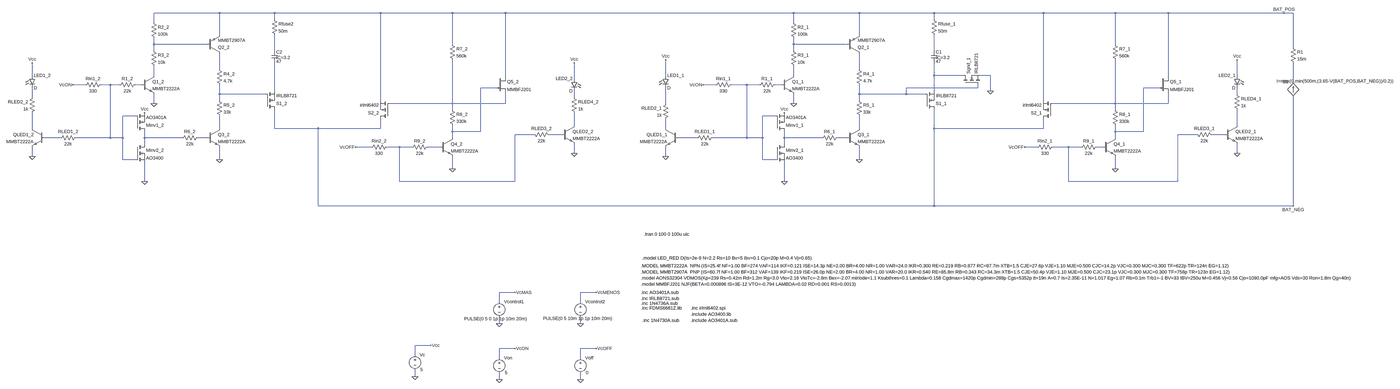
[diagram p0: schematic paralelo.asc, whole sheet]
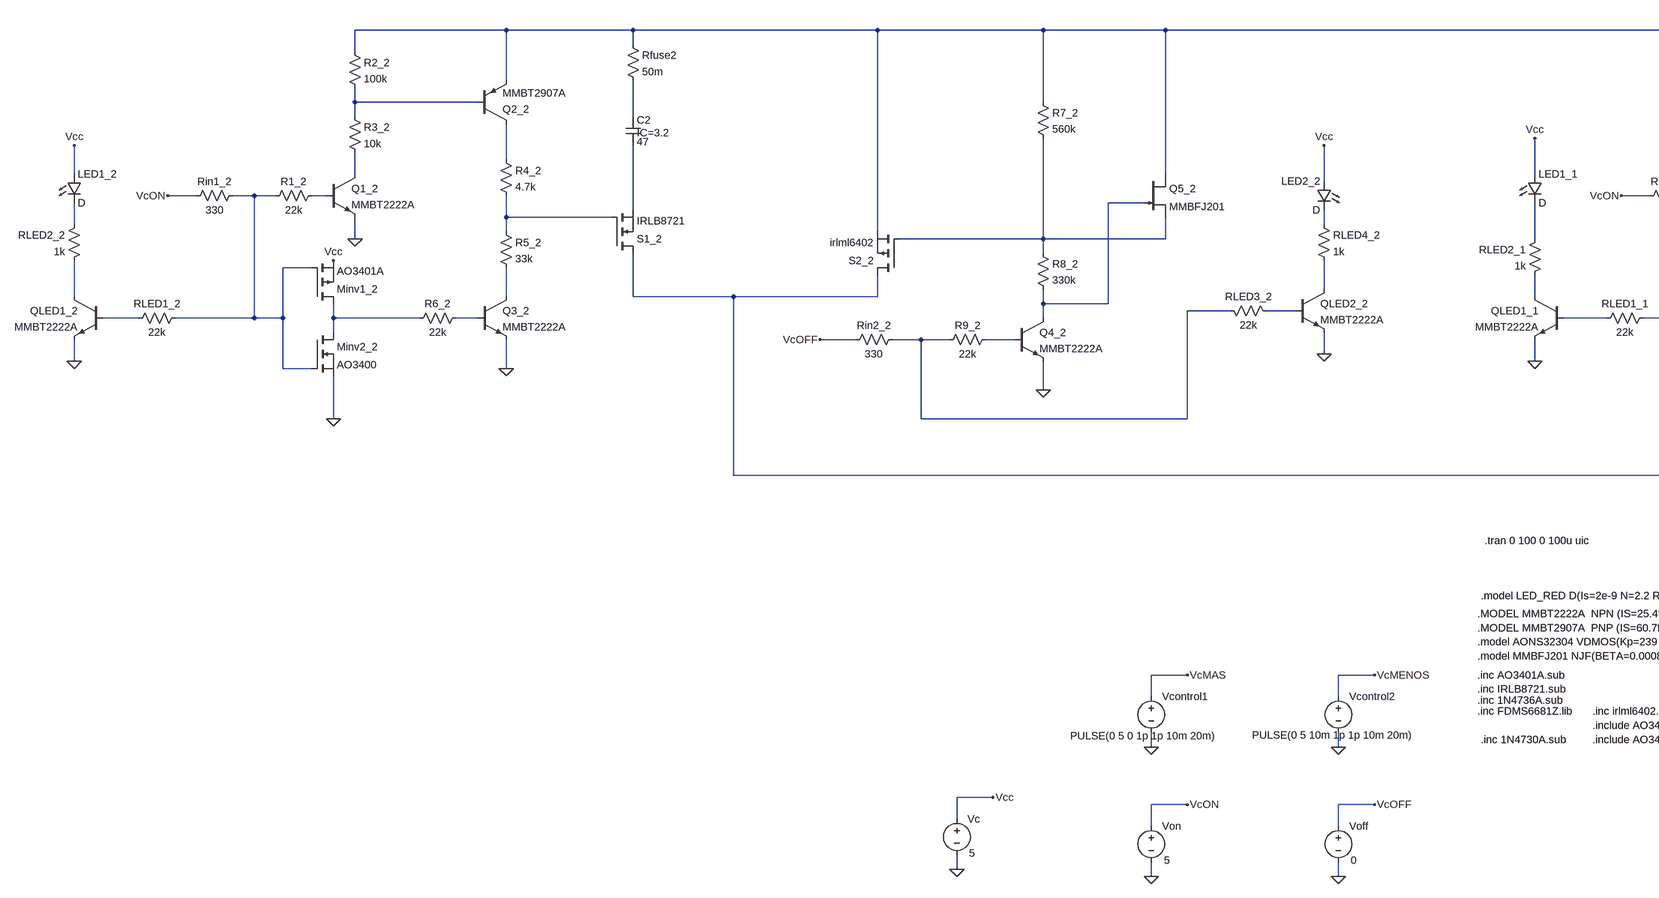
[diagram p1: schematic paralelo.asc, part, row 1 of 1, column 1 of 2]
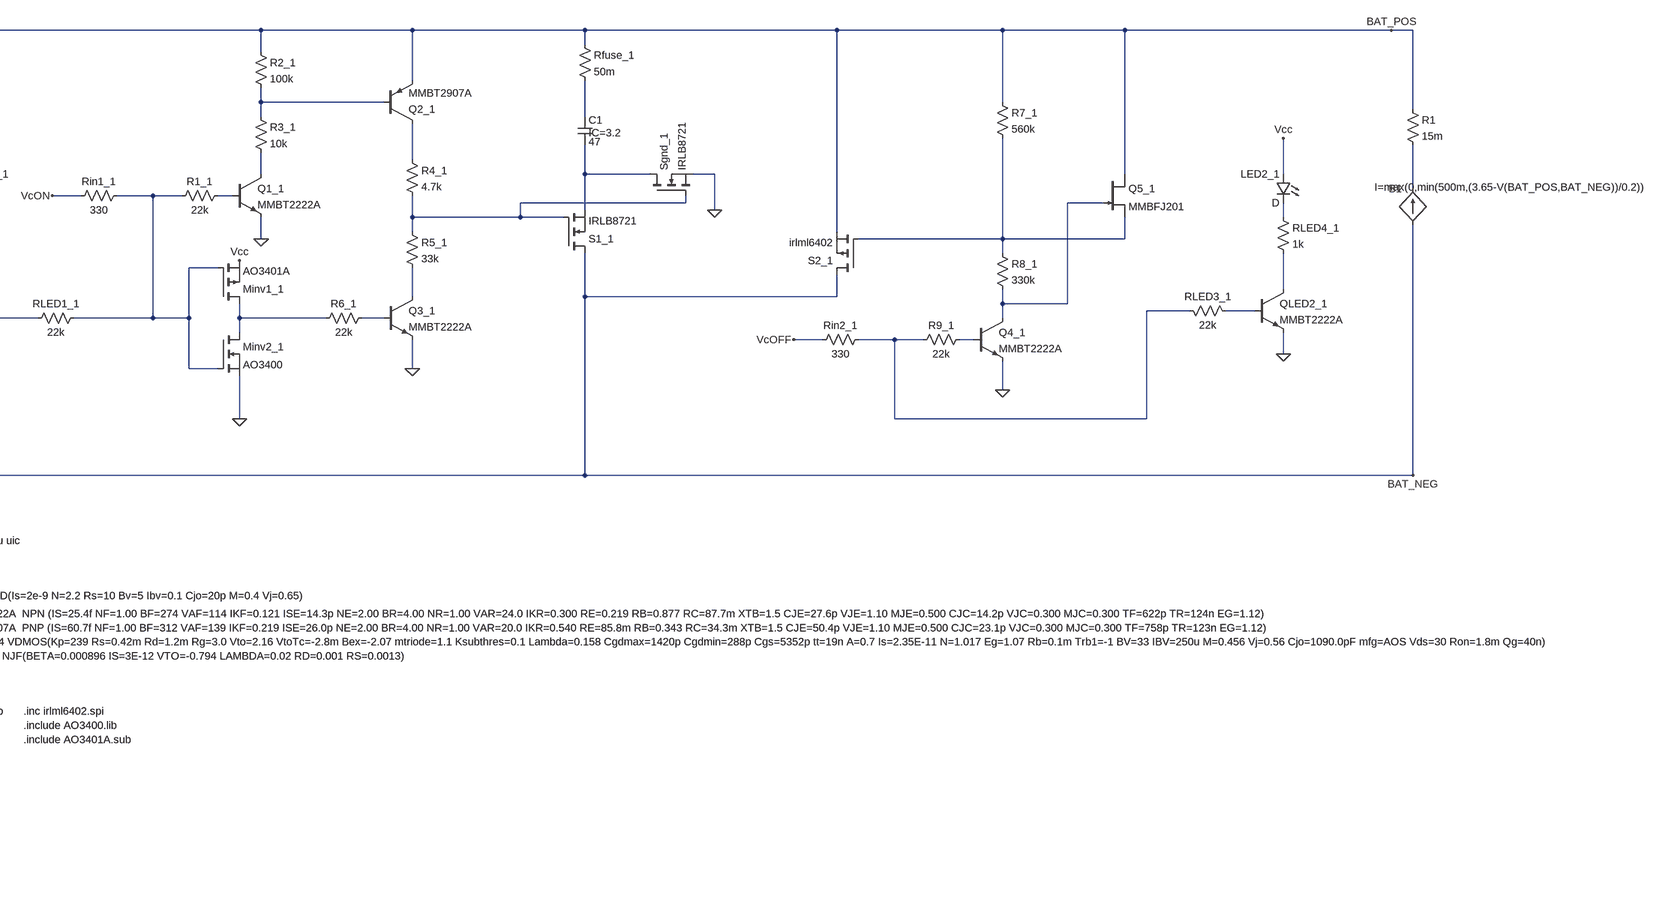
[diagram p2: schematic paralelo.asc, part, row 1 of 1, column 2 of 2]
paralelo.asc, the LTspice schematic file:
Version 4.1
SHEET 1 7672 2128
WIRE -2704 -688 -3040 -688
WIRE -2320 -688 -2704 -688
WIRE -1760 -688 -2320 -688
WIRE -1392 -688 -1760 -688
WIRE -1120 -688 -1392 -688
WIRE 560 -688 -1120 -688
WIRE 896 -688 560 -688
WIRE 1280 -688 896 -688
WIRE 1840 -688 1280 -688
WIRE 2208 -688 1840 -688
WIRE 2480 -688 2208 -688
WIRE 3072 -688 2480 -688
WIRE 3120 -688 3072 -688
WIRE -2320 -656 -2320 -688
WIRE 1280 -656 1280 -688
WIRE -3040 -640 -3040 -688
WIRE 560 -640 560 -688
WIRE -2704 -576 -2704 -688
WIRE 896 -576 896 -688
WIRE -3040 -528 -3040 -560
WIRE -2768 -528 -3040 -528
WIRE -1392 -528 -1392 -688
WIRE 560 -528 560 -560
WIRE 832 -528 560 -528
WIRE 2208 -528 2208 -688
WIRE 3120 -512 3120 -688
WIRE -3040 -496 -3040 -528
WIRE -2320 -496 -2320 -576
WIRE 560 -496 560 -528
WIRE 1280 -496 1280 -576
WIRE -2704 -400 -2704 -480
WIRE 896 -400 896 -480
WIRE -3664 -368 -3664 -432
WIRE -3040 -368 -3040 -416
WIRE -1120 -368 -1120 -688
WIRE -96 -368 -96 -448
WIRE 560 -368 560 -416
WIRE 1280 -368 1280 -432
WIRE 1424 -368 1280 -368
WIRE 1568 -368 1520 -368
WIRE 2480 -368 2480 -688
WIRE 2832 -368 2832 -448
WIRE -768 -352 -768 -432
WIRE 3120 -336 3120 -432
WIRE -3392 -320 -3456 -320
WIRE -3264 -320 -3312 -320
WIRE -3216 -320 -3264 -320
WIRE -3104 -320 -3136 -320
WIRE 160 -320 96 -320
WIRE 320 -320 240 -320
WIRE 384 -320 320 -320
WIRE 496 -320 464 -320
WIRE -1168 -304 -1248 -304
WIRE 1504 -304 1504 -320
WIRE 1504 -304 1136 -304
WIRE 2432 -304 2352 -304
WIRE -2320 -288 -2320 -432
WIRE 1280 -288 1280 -368
WIRE 1568 -288 1568 -368
WIRE -2704 -272 -2704 -320
WIRE -2368 -272 -2704 -272
WIRE 896 -272 896 -320
WIRE 1136 -272 1136 -304
WIRE 1136 -272 896 -272
WIRE 1232 -272 1136 -272
WIRE 2832 -272 2832 -304
WIRE -3664 -256 -3664 -304
WIRE -768 -256 -768 -288
WIRE -2704 -240 -2704 -272
WIRE -1760 -240 -1760 -688
WIRE 896 -240 896 -272
WIRE 1840 -240 1840 -688
WIRE -3040 -224 -3040 -272
WIRE -1392 -224 -1392 -448
WIRE -1392 -224 -1712 -224
WIRE -1120 -224 -1120 -272
WIRE -1120 -224 -1392 -224
WIRE -96 -224 -96 -304
WIRE 560 -224 560 -272
WIRE 2208 -224 2208 -448
WIRE 2208 -224 1888 -224
WIRE 2480 -224 2480 -272
WIRE 2480 -224 2208 -224
WIRE -1392 -192 -1392 -224
WIRE 2208 -192 2208 -224
WIRE -3136 -160 -3200 -160
WIRE 464 -160 400 -160
WIRE -768 -112 -768 -176
WIRE 2832 -112 2832 -192
WIRE -3664 -96 -3664 -176
WIRE -2704 -96 -2704 -160
WIRE -2320 -96 -2320 -192
WIRE -2080 -96 -2320 -96
WIRE -1760 -96 -1760 -144
WIRE -1760 -96 -2080 -96
WIRE -96 -96 -96 -144
WIRE 896 -96 896 -160
WIRE 1280 -96 1280 -192
WIRE 1840 -96 1840 -144
WIRE 1840 -96 1280 -96
WIRE -1392 -80 -1392 -112
WIRE -1248 -80 -1248 -304
WIRE -1248 -80 -1392 -80
WIRE 2208 -80 2208 -112
WIRE 2352 -80 2352 -304
WIRE 2352 -80 2208 -80
WIRE -976 -64 -1072 -64
WIRE -832 -64 -896 -64
WIRE 2624 -64 2528 -64
WIRE 2768 -64 2704 -64
WIRE -3520 -48 -3600 -48
WIRE -3264 -48 -3264 -320
WIRE -3264 -48 -3440 -48
WIRE -3200 -48 -3200 -160
WIRE -3200 -48 -3264 -48
WIRE -3088 -48 -3088 -80
WIRE -2896 -48 -3088 -48
WIRE -2768 -48 -2816 -48
WIRE -1392 -48 -1392 -80
WIRE 64 -48 -32 -48
WIRE 320 -48 320 -320
WIRE 320 -48 144 -48
WIRE 400 -48 400 -160
WIRE 400 -48 320 -48
WIRE 512 -48 512 -80
WIRE 704 -48 512 -48
WIRE 832 -48 784 -48
WIRE 2208 -48 2208 -80
WIRE -3088 -16 -3088 -48
WIRE 512 -16 512 -48
WIRE -1808 0 -1888 0
WIRE -1664 0 -1728 0
WIRE -1600 0 -1664 0
WIRE -1456 0 -1520 0
WIRE 1808 0 1744 0
WIRE 1968 0 1888 0
WIRE 2032 0 1968 0
WIRE 2144 0 2112 0
WIRE -768 32 -768 -16
WIRE 2832 32 2832 -16
WIRE -3664 48 -3664 0
WIRE -96 48 -96 0
WIRE -3200 64 -3200 -48
WIRE -3136 64 -3200 64
WIRE -2704 64 -2704 0
WIRE 400 64 400 -48
WIRE 464 64 400 64
WIRE 896 64 896 0
WIRE -1392 112 -1392 48
WIRE 2208 112 2208 48
WIRE -3088 176 -3088 80
WIRE -1664 176 -1664 0
WIRE -1072 176 -1072 -64
WIRE -1072 176 -1664 176
WIRE 512 176 512 80
WIRE 1968 176 1968 0
WIRE 2528 176 2528 -64
WIRE 2528 176 1968 176
WIRE -2080 320 -2080 -96
WIRE 1280 320 1280 -96
WIRE 1280 320 -2080 320
WIRE 3120 320 3120 -256
WIRE 3120 320 1280 320
WIRE -1072 1024 -1152 1024
WIRE -656 1024 -736 1024
WIRE -1152 1072 -1152 1024
WIRE -736 1072 -736 1024
WIRE -1152 1184 -1152 1152
WIRE -736 1184 -736 1152
WIRE -1504 1296 -1584 1296
WIRE -1072 1312 -1152 1312
WIRE -656 1312 -736 1312
WIRE -1584 1344 -1584 1296
WIRE -1152 1360 -1152 1312
WIRE -736 1360 -736 1312
WIRE -1584 1456 -1584 1424
WIRE -1152 1472 -1152 1440
WIRE -736 1472 -736 1440
FLAG 560 -224 0
FLAG 896 64 0
FLAG -1152 1184 0
FLAG -736 1184 0
FLAG -1072 1024 VcMAS
FLAG -656 1024 VcMENOS
FLAG -736 1472 0
FLAG -656 1312 VcOFF
FLAG -1152 1472 0
FLAG -1072 1312 VcON
FLAG 96 -320 VcON
FLAG 2208 112 0
FLAG 1744 0 VcOFF
FLAG -96 48 0
FLAG 2832 32 0
FLAG -96 -448 Vcc
FLAG 2832 -448 Vcc
FLAG -1584 1456 0
FLAG -1504 1296 Vcc
FLAG 512 176 0
FLAG 512 -176 Vcc
FLAG 1568 -288 0
FLAG -3040 -224 0
FLAG -2704 64 0
FLAG -3456 -320 VcON
FLAG -1392 112 0
FLAG -1888 0 VcOFF
FLAG -3664 48 0
FLAG -768 32 0
FLAG -3664 -432 Vcc
FLAG -768 -432 Vcc
FLAG -3088 176 0
FLAG -3088 -176 Vcc
FLAG 3120 320 BAT_NEG
FLAG 3072 -688 BAT_POS
SYMBOL npn 832 -96 R0
SYMATTR InstName Q3_1
SYMATTR Value MMBT2222A
SYMBOL res 880 -256 R0
SYMATTR InstName R5_1
SYMATTR Value 33k
SYMBOL res 880 -416 R0
SYMATTR InstName R4_1
SYMATTR Value 4.7k
SYMBOL npn 496 -368 R0
SYMATTR InstName Q1_1
SYMATTR Value MMBT2222A
SYMBOL res 544 -512 R0
SYMATTR InstName R3_1
SYMATTR Value 10k
SYMBOL res 544 -656 R0
SYMATTR InstName R2_1
SYMATTR Value 100k
SYMBOL res 800 -64 R90
WINDOW 0 0 56 VBottom 2
WINDOW 3 32 56 VTop 2
SYMATTR InstName R6_1
SYMATTR Value 22k
SYMBOL pnp 832 -480 M180
SYMATTR InstName Q2_1
SYMATTR Value MMBT2907A
SYMBOL nmos 1232 -192 M180
SYMATTR InstName S1_1
SYMATTR Value IRLB8721
SYMATTR Prefix X
SYMBOL voltage -1152 1056 R0
WINDOW 3 -180 103 Left 2
WINDOW 123 0 0 Left 0
WINDOW 39 0 0 Left 0
SYMATTR Value PULSE(0 5 0 1p 1p 10m 20m)
SYMATTR InstName Vcontrol1
SYMBOL voltage -736 1056 R0
WINDOW 3 -192 102 Left 2
WINDOW 123 0 0 Left 0
WINDOW 39 0 0 Left 0
SYMATTR Value PULSE(0 5 10m 1p 1p 10m 20m)
SYMATTR InstName Vcontrol2
SYMBOL voltage -736 1344 R0
WINDOW 3 27 92 Left 2
WINDOW 123 0 0 Left 0
WINDOW 39 0 0 Left 0
SYMATTR Value 0
SYMATTR InstName Voff
SYMBOL voltage -1152 1344 R0
WINDOW 3 28 92 Left 2
WINDOW 123 0 0 Left 0
WINDOW 39 0 0 Left 0
SYMATTR Value 5
SYMATTR InstName Von
SYMBOL res 480 -336 R90
WINDOW 0 0 56 VBottom 2
WINDOW 3 32 56 VTop 2
SYMATTR InstName R1_1
SYMATTR Value 22k
SYMBOL res 1264 -672 R0
SYMATTR InstName Rfuse_1
SYMATTR Value 50m
SYMBOL npn 2144 -48 R0
SYMATTR InstName Q4_1
SYMATTR Value MMBT2222A
SYMBOL res 2128 -16 R90
WINDOW 0 0 56 VBottom 2
WINDOW 3 32 56 VTop 2
SYMATTR InstName R9_1
SYMATTR Value 22k
SYMBOL res 2192 -544 R0
SYMATTR InstName R7_1
SYMATTR Value 560k
SYMBOL pmos 1888 -144 R180
SYMATTR InstName S2_1
SYMATTR Value irlml6402
SYMATTR Prefix X
SYMBOL npn -32 -96 M0
SYMATTR InstName QLED1_1
SYMATTR Value MMBT2222A
SYMBOL res -80 -240 M0
SYMATTR InstName RLED2_1
SYMATTR Value 1k
SYMBOL res 160 -64 R90
WINDOW 0 0 56 VBottom 2
WINDOW 3 32 56 VTop 2
SYMATTR InstName RLED1_1
SYMATTR Value 22k
SYMBOL LED -112 -368 R0
SYMATTR InstName LED1_1
SYMBOL npn 2768 -112 R0
SYMATTR InstName QLED2_1
SYMATTR Value MMBT2222A
SYMBOL res 2816 -288 R0
SYMATTR InstName RLED4_1
SYMATTR Value 1k
SYMBOL res 2608 -80 M90
WINDOW 0 0 56 VBottom 2
WINDOW 3 32 56 VTop 2
SYMATTR InstName RLED3_1
SYMATTR Value 22k
SYMBOL LED 2848 -368 M0
SYMATTR InstName LED2_1
SYMBOL res 2192 -208 R0
SYMATTR InstName R8_1
SYMATTR Value 330k
SYMBOL voltage -1584 1328 R0
WINDOW 3 27 92 Left 2
WINDOW 123 0 0 Left 0
WINDOW 39 0 0 Left 0
SYMATTR Value 5
SYMATTR InstName Vc
SYMBOL pmos 464 -80 M180
SYMATTR InstName Minv1_1
SYMATTR Value AO3401A
SYMATTR Prefix X
SYMBOL nmos 464 -16 R0
SYMATTR InstName Minv2_1
SYMATTR Value AO3400
SYMATTR Prefix X
SYMBOL njf 2432 -368 R0
SYMATTR InstName Q5_1
SYMATTR Value MMBFJ201
SYMBOL nmos 1424 -320 R270
SYMATTR InstName Sgnd_1
SYMATTR Value IRLB8721
SYMATTR Prefix X
SYMBOL npn -2768 -96 R0
SYMATTR InstName Q3_2
SYMATTR Value MMBT2222A
SYMBOL res -2720 -256 R0
SYMATTR InstName R5_2
SYMATTR Value 33k
SYMBOL res -2720 -416 R0
SYMATTR InstName R4_2
SYMATTR Value 4.7k
SYMBOL npn -3104 -368 R0
SYMATTR InstName Q1_2
SYMATTR Value MMBT2222A
SYMBOL res -3056 -512 R0
SYMATTR InstName R3_2
SYMATTR Value 10k
SYMBOL res -3056 -656 R0
SYMATTR InstName R2_2
SYMATTR Value 100k
SYMBOL res -2800 -64 R90
WINDOW 0 0 56 VBottom 2
WINDOW 3 32 56 VTop 2
SYMATTR InstName R6_2
SYMATTR Value 22k
SYMBOL pnp -2768 -480 M180
SYMATTR InstName Q2_2
SYMATTR Value MMBT2907A
SYMBOL nmos -2368 -192 M180
SYMATTR InstName S1_2
SYMATTR Value IRLB8721
SYMATTR Prefix X
SYMBOL res -3120 -336 R90
WINDOW 0 0 56 VBottom 2
WINDOW 3 32 56 VTop 2
SYMATTR InstName R1_2
SYMATTR Value 22k
SYMBOL res -2336 -672 R0
SYMATTR InstName Rfuse2
SYMATTR Value 50m
SYMBOL npn -1456 -48 R0
SYMATTR InstName Q4_2
SYMATTR Value MMBT2222A
SYMBOL res -1504 -16 R90
WINDOW 0 0 56 VBottom 2
WINDOW 3 32 56 VTop 2
SYMATTR InstName R9_2
SYMATTR Value 22k
SYMBOL res -1408 -544 R0
SYMATTR InstName R7_2
SYMATTR Value 560k
SYMBOL pmos -1712 -144 R180
SYMATTR InstName S2_2
SYMATTR Value irlml6402
SYMATTR Prefix X
SYMBOL npn -3600 -96 M0
SYMATTR InstName QLED1_2
SYMATTR Value MMBT2222A
SYMBOL res -3648 -272 M0
SYMATTR InstName RLED2_2
SYMATTR Value 1k
SYMBOL res -3424 -64 R90
WINDOW 0 0 56 VBottom 2
WINDOW 3 32 56 VTop 2
SYMATTR InstName RLED1_2
SYMATTR Value 22k
SYMBOL LED -3680 -368 R0
SYMATTR InstName LED1_2
SYMBOL npn -832 -112 R0
SYMATTR InstName QLED2_2
SYMATTR Value MMBT2222A
SYMBOL res -784 -272 R0
SYMATTR InstName RLED4_2
SYMATTR Value 1k
SYMBOL res -992 -80 M90
WINDOW 0 0 56 VBottom 2
WINDOW 3 32 56 VTop 2
SYMATTR InstName RLED3_2
SYMATTR Value 22k
SYMBOL LED -752 -352 M0
SYMATTR InstName LED2_2
SYMBOL res -1408 -208 R0
SYMATTR InstName R8_2
SYMATTR Value 330k
SYMBOL pmos -3136 -80 M180
SYMATTR InstName Minv1_2
SYMATTR Value AO3401A
SYMATTR Prefix X
SYMBOL nmos -3136 -16 R0
SYMATTR InstName Minv2_2
SYMATTR Value AO3400
SYMATTR Prefix X
SYMBOL njf -1168 -368 R0
SYMATTR InstName Q5_2
SYMATTR Value MMBFJ201
SYMBOL res 256 -336 R90
WINDOW 0 0 56 VBottom 2
WINDOW 3 32 56 VTop 2
SYMATTR InstName Rin1_1
SYMATTR Value 330
SYMBOL res -3296 -336 R90
WINDOW 0 0 56 VBottom 2
WINDOW 3 32 56 VTop 2
SYMATTR InstName Rin1_2
SYMATTR Value 330
SYMBOL res 1904 -16 R90
WINDOW 0 0 56 VBottom 2
WINDOW 3 32 56 VTop 2
SYMATTR InstName Rin2_1
SYMATTR Value 330
SYMBOL res -1712 -16 R90
WINDOW 0 0 56 VBottom 2
WINDOW 3 32 56 VTop 2
SYMATTR InstName Rin2_2
SYMATTR Value 330
SYMBOL cap 1264 -496 R0
WINDOW 40 24 36 Left 2
SYMATTR SpiceLine2 IC=3.2
SYMATTR InstName C1
SYMATTR Value 47
SYMATTR SpiceLine V=5
SYMBOL cap -2336 -496 R0
WINDOW 40 24 36 Left 2
SYMATTR SpiceLine2 IC=3.2
SYMATTR InstName C2
SYMATTR Value 47
SYMATTR SpiceLine V=5
SYMBOL bi 3120 -256 R180
WINDOW 0 24 80 Left 2
WINDOW 3 -515 83 Left 2
SYMATTR InstName B1
SYMATTR Value I=max(0,min(500m,(3.65-V(BAT_POS,BAT_NEG))/0.2))
SYMBOL res 3104 -528 R0
SYMATTR InstName R1
SYMATTR Value 15m
TEXT -208 600 Left 2 !.tran 0 100 0 100u uic
TEXT -224 888 Left 2 !.MODEL MMBT2222A  NPN (IS=25.4f NF=1.00 BF=274 VAF=114 IKF=0.121 ISE=14.3p NE=2.00 BR=4.00 NR=1.00 VAR=24.0 IKR=0.300 RE=0.219 RB=0.877 RC=87.7m XTB=1.5 CJE=27.6p VJE=1.10 MJE=0.500 CJC=14.2p VJC=0.300 MJC=0.300 TF=622p TR=124n EG=1.12)\n.MODEL MMBT2907A  PNP (IS=60.7f NF=1.00 BF=312 VAF=139 IKF=0.219 ISE=26.0p NE=2.00 BR=4.00 NR=1.00 VAR=20.0 IKR=0.540 RE=85.8m RB=0.343 RC=34.3m XTB=1.5 CJE=50.4p VJE=1.10 MJE=0.500 CJC=23.1p VJC=0.300 MJC=0.300 TF=758p TR=123n EG=1.12)\n.model AONS32304 VDMOS(Kp=239 Rs=0.42m Rd=1.2m Rg=3.0 Vto=2.16 VtoTc=-2.8m Bex=-2.07 mtriode=1.1 Ksubthres=0.1 Lambda=0.158 Cgdmax=1420p Cgdmin=288p Cgs=5352p tt=19n A=0.7 Is=2.35E-11 N=1.017 Eg=1.07 Rb=0.1m Trb1=-1 BV=33 IBV=250u M=0.456 Vj=0.56 Cjo=1090.0pF mfg=AOS Vds=30 Ron=1.8m Qg=40n)\n.model MMBFJ201 NJF(BETA=0.000896 IS=3E-12 VTO=-0.794 LAMBDA=0.02 RD=0.001 RS=0.0013)
TEXT -224 1024 Left 2 !.inc AO3401A.sub\n.inc IRLB8721.sub
TEXT -224 1080 Left 2 !.inc 1N4736A.sub
TEXT -224 1104 Left 2 !.inc FDMS6681Z.lib
TEXT -216 1168 Left 2 !.inc 1N4730A.sub
TEXT -216 848 Left 2 !.model LED_RED D(Is=2e-9 N=2.2 Rs=10 Bv=5 Ibv=0.1 Cjo=20p M=0.4 Vj=0.65)
TEXT 32 1104 Left 2 !.inc irlml6402.spi
TEXT 32 1136 Left 2 !.include AO3400.lib
TEXT 32 1168 Left 2 !.include AO3401A.sub

The netlist it stands for:
* paralelo.asc
Q3_1 N031 N041 0 0 MMBT2222A
R5_1 N016 N031 33k
R4_1 N006 N016 4.7k
Q1_1 N008 N014 0 0 MMBT2222A
R3_1 N002 N008 10k
R2_1 BAT_POS N002 100k
R6_1 N041 N040 22k
Q2_1 N006 N002 BAT_POS 0 MMBT2907A
X§S1_1 BAT_NEG N016 N009 IRLB8721  ; pins D G S
Vcontrol1 VcMAS 0 PULSE(0 5 0 1p 1p 10m 20m)
Vcontrol2 VcMENOS 0 PULSE(0 5 10m 1p 1p 10m 20m)
Voff VcOFF 0 0
Von VcON 0 5
R1_1 N014 N013 22k
Rfuse_1 BAT_POS N004 50m
Q4_1 N017 N043 0 0 MMBT2222A
R9_1 N043 N034 22k
R7_1 BAT_POS N025 560k
X§S2_1 BAT_NEG N025 BAT_POS irlml6402  ; pins D G S
QLED1_1 N030 N039 0 0 MMBT2222A
RLED2_1 N024 N030 1k
RLED1_1 N013 N039 22k
D§LED1_1 Vcc N024 D
QLED2_1 N027 N035 0 0 MMBT2222A
RLED4_1 N020 N027 1k
RLED3_1 N034 N035 22k
D§LED2_1 Vcc N020 D
R8_1 N025 N017 330k
Vc Vcc 0 5
X§Minv1_1 N040 N013 Vcc AO3401A  ; pins D G S
X§Minv2_1 N040 N013 0 AO3400  ; pins D G S
J§Q5_1 BAT_POS N017 N025 MMBFJ201
X§Sgnd_1 N009 N016 0 IRLB8721  ; pins D G S
Q3_2 N029 N038 0 0 MMBT2222A
R5_2 N019 N029 33k
R4_2 N005 N019 4.7k
Q1_2 N007 N012 0 0 MMBT2222A
R3_2 N001 N007 10k
R2_2 BAT_POS N001 100k
R6_2 N038 N037 22k
Q2_2 N005 N001 BAT_POS 0 MMBT2907A
X§S1_2 BAT_NEG N019 N018 IRLB8721  ; pins D G S
R1_2 N012 N011 22k
Rfuse2 BAT_POS N003 50m
Q4_2 N015 N042 0 0 MMBT2222A
R9_2 N042 N032 22k
R7_2 BAT_POS N023 560k
X§S2_2 BAT_NEG N023 BAT_POS irlml6402  ; pins D G S
QLED1_2 N028 N036 0 0 MMBT2222A
RLED2_2 N021 N028 1k
RLED1_2 N011 N036 22k
D§LED1_2 Vcc N021 D
QLED2_2 N026 N033 0 0 MMBT2222A
RLED4_2 N022 N026 1k
RLED3_2 N032 N033 22k
D§LED2_2 Vcc N022 D
R8_2 N023 N015 330k
X§Minv1_2 N037 N011 Vcc AO3401A  ; pins D G S
X§Minv2_2 N037 N011 0 AO3400  ; pins D G S
J§Q5_2 BAT_POS N015 N023 MMBFJ201
Rin1_1 N013 VcON 330
Rin1_2 N011 VcON 330
Rin2_1 N034 VcOFF 330
Rin2_2 N032 VcOFF 330
C1 N004 N009 47 V=5 IC=3.2
C2 N003 N018 47 V=5 IC=3.2
B1 BAT_NEG N010 I=max(0,min(500m,(3.65-V(BAT_POS,BAT_NEG))/0.2))
R1 BAT_POS N010 15m
.model D D
.lib standard.dio
.model NPN NPN
.model PNP PNP
.lib standard.bjt
.model NJF NJF
.model PJF PJF
.lib standard.jft
.tran 0 100 0 100u uic
.MODEL MMBT2222A  NPN (IS=25.4f NF=1.00 BF=274 VAF=114 IKF=0.121 ISE=14.3p NE=2.00 BR=4.00 NR=1.00 VAR=24.0 IKR=0.300 RE=0.219 RB=0.877 RC=87.7m XTB=1.5 CJE=27.6p VJE=1.10 MJE=0.500 CJC=14.2p VJC=0.300 MJC=0.300 TF=622p TR=124n EG=1.12)
.MODEL MMBT2907A  PNP (IS=60.7f NF=1.00 BF=312 VAF=139 IKF=0.219 ISE=26.0p NE=2.00 BR=4.00 NR=1.00 VAR=20.0 IKR=0.540 RE=85.8m RB=0.343 RC=34.3m XTB=1.5 CJE=50.4p VJE=1.10 MJE=0.500 CJC=23.1p VJC=0.300 MJC=0.300 TF=758p TR=123n EG=1.12)
.model AONS32304 VDMOS(Kp=239 Rs=0.42m Rd=1.2m Rg=3.0 Vto=2.16 VtoTc=-2.8m Bex=-2.07 mtriode=1.1 Ksubthres=0.1 Lambda=0.158 Cgdmax=1420p Cgdmin=288p Cgs=5352p tt=19n A=0.7 Is=2.35E-11 N=1.017 Eg=1.07 Rb=0.1m Trb1=-1 BV=33 IBV=250u M=0.456 Vj=0.56 Cjo=1090.0pF mfg=AOS Vds=30 Ron=1.8m Qg=40n)
.model MMBFJ201 NJF(BETA=0.000896 IS=3E-12 VTO=-0.794 LAMBDA=0.02 RD=0.001 RS=0.0013)
.inc AO3401A.sub
.inc IRLB8721.sub
.inc 1N4736A.sub
.inc FDMS6681Z.lib
.inc 1N4730A.sub
.model LED_RED D(Is=2e-9 N=2.2 Rs=10 Bv=5 Ibv=0.1 Cjo=20p M=0.4 Vj=0.65)
.inc irlml6402.spi
.include AO3400.lib
.include AO3401A.sub
.backanno
.end